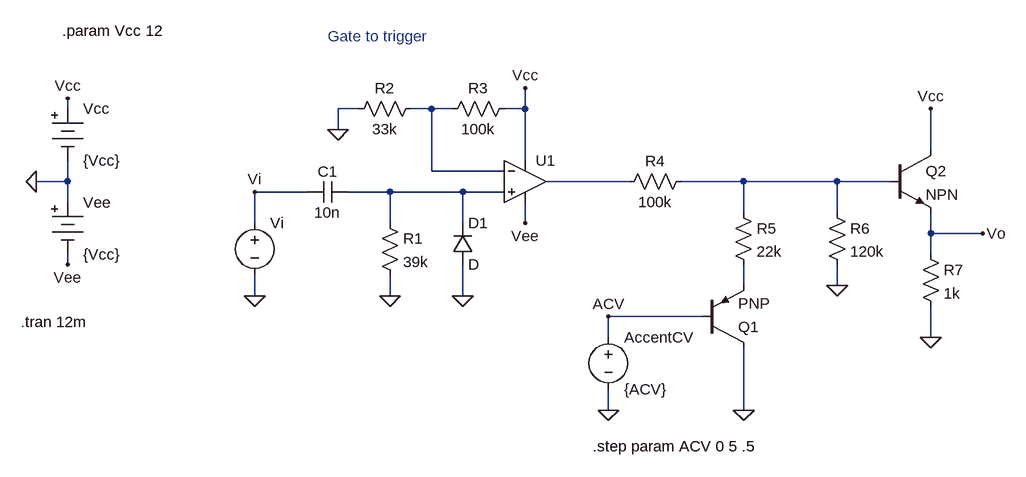
[diagram p0: schematic kick_input.asc]
kick_input.asc, the LTspice schematic file:
Version 4
SHEET 1 1136 680
WIRE -320 48 -320 32
WIRE 128 48 96 48
WIRE 240 48 208 48
WIRE 272 48 240 48
WIRE 384 48 384 16
WIRE 384 48 352 48
WIRE 96 80 96 48
WIRE 1008 112 1008 48
WIRE 384 128 384 48
WIRE 240 144 240 48
WIRE 352 144 240 144
WIRE -320 160 -320 128
WIRE -320 160 -368 160
WIRE 544 160 416 160
WIRE 720 160 624 160
WIRE 864 160 720 160
WIRE 944 160 864 160
WIRE 48 176 -32 176
WIRE 176 176 112 176
WIRE 288 176 176 176
WIRE 352 176 288 176
WIRE -320 192 -320 160
WIRE 720 208 720 160
WIRE 864 208 864 160
WIRE -32 224 -32 176
WIRE 176 224 176 176
WIRE 288 224 288 176
WIRE 384 224 384 192
WIRE 1008 240 1008 208
WIRE 1088 240 1008 240
WIRE 1008 272 1008 240
WIRE -320 288 -320 272
WIRE 720 320 720 288
WIRE 864 320 864 288
WIRE -32 336 -32 304
WIRE 176 336 176 304
WIRE 288 336 288 288
WIRE 656 368 512 368
WIRE 512 400 512 368
WIRE 1008 400 1008 352
WIRE 512 512 512 480
WIRE 720 512 720 416
FLAG 176 336 0
FLAG 288 336 0
FLAG 96 80 0
FLAG -320 32 Vcc
FLAG -320 288 Vee
FLAG -368 160 0
FLAG 384 16 Vcc
FLAG 384 224 Vee
FLAG -32 336 0
FLAG -32 176 Vi
FLAG 720 512 0
FLAG 864 320 0
FLAG 512 512 0
FLAG 512 368 ACV
FLAG 1008 48 Vcc
FLAG 1088 240 Vo
FLAG 1008 400 0
SYMBOL cap 112 160 R90
WINDOW 0 0 32 VBottom 2
WINDOW 3 32 32 VTop 2
SYMATTR InstName C1
SYMATTR Value 10n
SYMBOL res 160 208 R0
SYMATTR InstName R1
SYMATTR Value 39k
SYMBOL diode 272 288 M180
WINDOW 0 24 64 Left 2
WINDOW 3 24 0 Left 2
SYMATTR InstName D1
SYMBOL OpAmps\\UniversalOpAmp2 384 160 R0
SYMATTR InstName U1
SYMBOL res 368 32 R90
WINDOW 0 0 56 VBottom 2
WINDOW 3 32 56 VTop 2
SYMATTR InstName R3
SYMATTR Value 100k
SYMBOL res 224 32 R90
WINDOW 0 0 56 VBottom 2
WINDOW 3 32 56 VTop 2
SYMATTR InstName R2
SYMATTR Value 33k
SYMBOL Misc\\battery -320 32 R0
SYMATTR InstName Vcc
SYMATTR Value {Vcc}
SYMBOL Misc\\battery -320 176 R0
SYMATTR InstName Vee
SYMATTR Value {Vcc}
SYMBOL voltage -32 208 R0
WINDOW 3 24 96 Invisible 2
WINDOW 123 0 0 Left 0
WINDOW 39 0 0 Left 0
SYMATTR Value PULSE(0 5 1ms 0 0 3ms 5ms)
SYMATTR InstName Vi
SYMBOL res 640 144 R90
WINDOW 0 0 56 VBottom 2
WINDOW 3 32 56 VTop 2
SYMATTR InstName R4
SYMATTR Value 100k
SYMBOL pnp 656 416 M180
SYMATTR InstName Q1
SYMBOL npn 944 112 R0
SYMATTR InstName Q2
SYMBOL res 704 192 R0
SYMATTR InstName R5
SYMATTR Value 22k
SYMBOL res 848 192 R0
SYMATTR InstName R6
SYMATTR Value 120k
SYMBOL voltage 512 384 R0
WINDOW 123 0 0 Left 0
WINDOW 39 0 0 Left 0
SYMATTR InstName AccentCV
SYMATTR Value {ACV}
SYMBOL res 992 256 R0
SYMATTR InstName R7
SYMATTR Value 1k
TEXT -328 -72 Left 2 !.param Vcc 12
TEXT -392 376 Left 2 !.tran 12m
TEXT 488 568 Left 2 !.step param ACV 0 5 .5
TEXT 80 -64 Left 2 ;Gate to trigger

The netlist it stands for:
* kick_input.asc
C1 N004 Vi 10n
R1 N004 0 39k
D1 0 N004 D
XU1 N004 N001 Vcc Vee N002 level2 Avol=1Meg GBW=10Meg Slew=10Meg Ilimit=25m Rail=0 Vos=0 En=0 Enk=0 In=0 Ink=0 Rin=500Meg  ; pins In+ In- V+ V- OUT
R3 Vcc N001 100k
R2 N001 0 33k
Vcc Vcc 0 {Vcc}
Vee 0 Vee {Vcc}
Vi Vi 0 PULSE(0 5 1ms 0 0 3ms 5ms)
R4 N003 N002 100k
Q1 0 ACV N005 0 PNP
Q2 Vcc N003 Vo 0 NPN
R5 N003 N005 22k
R6 N003 0 120k
V§AccentCV ACV 0 {ACV}
R7 Vo 0 1k
.model D D
.lib standard.dio
.model NPN NPN
.model PNP PNP
.lib standard.bjt
.param Vcc 12
.tran 12m
.step param ACV 0 5 .5
* Gate to trigger
.lib UniversalOpAmp2.lib
.backanno
.end